# Altium schematic sheet HBridge.SchDoc
size A4; SheetNumber: 8; SheetTotal: 13
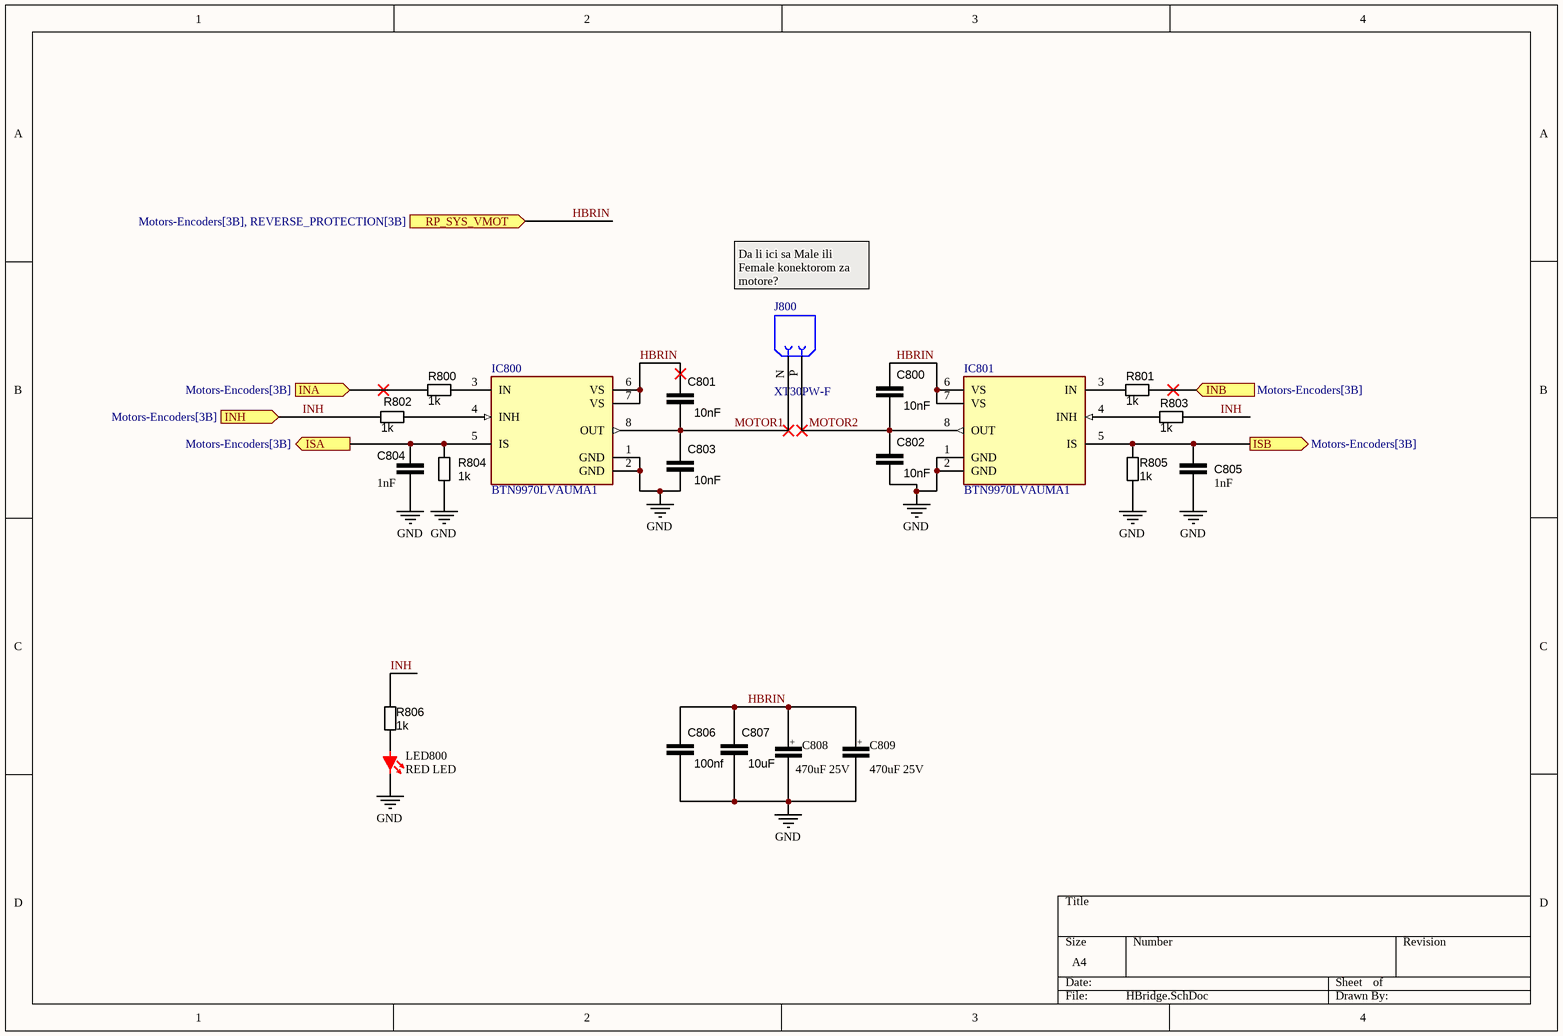
[diagram p0: HBridge.SchDoc]

## Parts
C800  10nF  [CAP_0603]
C801  10nF  [CAP_0603]
C802  10nF  [CAP_0603]
C803  10nF  [CAP_0603]
C804  1nF  [CAP_0603]
C805  1nF  [CAP_0603]
C806  100nf  [CAP_0603]
C807  10uF  [CAP_0603]
C808  470uF 25V  [WCAP-ATG5_8X11.5(DXL)]
C809  470uF 25V  [WCAP-ATG5_8X11.5(DXL)]
IC800  BTN9970LVAUMA1  [FP-PG-HSOF-7-MFG]
IC801  BTN9970LVAUMA1  [FP-PG-HSOF-7-MFG]
J800  XT30PW-F  [AMASS_XT30PW-F]
LED800  RED LED  [DIOC1608X04N-RED]
R800  1k  [RES_0603]
R801  1k  [RES_0603]
R802  1k  [RES_0603]
R803  1k  [RES_0603]
R804  1k  [RES_0603]
R805  1k  [RES_0603]
R806  1k  [RES_0603]

## Ports
INA (in, see Motors-Encoders[3B]), INB (in, see Motors-Encoders[3B]), INH (in, see Motors-Encoders[3B]), ISA (out, see Motors-Encoders[3B]), ISB (out, see Motors-Encoders[3B]), RP_SYS_VMOT (in, see Motors-Encoders[3B], REVERSE_PROTECTION[3B])

## Nets
GND: C802.1 C803.1 C804.1 C805.1 C806.1 C807.1 C808.2(NEG) C809.2(NEG) IC800.1(GND) IC800.2(GND) IC801.1(GND) IC801.2(GND) LED800.2 R804.2 R805.2
HBRIN: C800.2 C801.2 C806.2 C807.2 C808.1(POS) C809.1(POS) IC800.6(VS) IC800.7(VS) IC801.6(VS) IC801.7(VS) ; port RP_SYS_VMOT
INA: R800.2 ; port INA
INB: R801.2 ; port INB
INH: R802.2 R803.2 R806.1 ; port INH
ISA: C804.2 IC800.5(IS) R804.1 ; port ISA
ISB: C805.2 IC801.5(IS) R805.1 ; port ISB
MOTOR1: C801.1 C803.2 IC800.8(OUT) J800.N
MOTOR2: C800.1 C802.2 IC801.8(OUT) J800.P
NetIC800_3: IC800.3(IN) R800.1
NetIC800_4: IC800.4(INH) R802.1
NetIC801_3: IC801.3(IN) R801.1
NetIC801_4: IC801.4(INH) R803.1
NetLED800_1: LED800.1 R806.2

## Notes on the sheet
- Da li ici sa Male ili Female konektorom za motore?
- (in symbol WCAP-ATG5_8X11.5) +

## Library data of the parts
C800-C803 = C000007: CAP CER 10nF 0603 25V X7R; capaticanse: 100nf; ComponentLink1Description: digikey; ComponentLink1URL: https://www.digikey.com/en/products/detail/kyocera-avx/06033C104K4T2A/8019250
C804 C805 = C000021: CAP CER 1nF 0603 25V X7R; capacitance: 82pF; ComponentLink1Description: DigiKey; ComponentLink1URL: https://www.digikey.com/en/products/detail/kyocera-avx/KGM15ACG1E820FT/1599315?s=N4IgjCBcoMxaBjKAzAhgGwM4FMA0IB7KAbXDBggF18AHAFyhAGU6AnASwDsBzEAX3xgALPBBJIaLHkIlwAVgCcAJiEB2ENRD1GLDj36CAbKPGSc%2BIpFIxlQ45u2RmbLrwEglABiEKTKDOYyViAAHEoABDQAYhq0DE4AqpzsdADyyACy2KiYAK6s2AYgALRKfpBsudKWpHIafA1AA; DigiKey Part Number: 478-KGM15ACG1E820FTCT-ND
C806 = C000007: CAP CER 100nF 0603 25V X7R; capaticanse: 100nf; ComponentLink1Description: digikey; ComponentLink1URL: https://www.digikey.com/en/products/detail/kyocera-avx/06033C104K4T2A/8019250
C807 = C000007: CAP CER 10uF 0603 25V X7R; capaticanse: 100nf; ComponentLink1Description: digikey; ComponentLink1URL: https://www.digikey.com/en/products/detail/kyocera-avx/06033C104K4T2A/8019250
C808 C809 = WCAP-ATG5_8X11.5: <b>WCAP-ATG5 Aluminium Electrolytic Capacitors </B><BR><BR> <B>General Purpose +105 Â°C </B><BR><BR> <B>Characteristics</B><BR> <BR>General purpose product series with max. operating temperature of +105 Â°C  <BR>Mounting style: THT Radial  <BR>Capacitance range: 0.1 ÂµF â€’ 18000 ÂµF  <BR>Capacitance tolerance: Â±20 %  <BR>Operating temperature:  <BR>-40 Â°C up to +105 Â°C for UR < 400 V(DC)  <BR>-25 Â°C up to +105 Â°C for UR â‰¥ 400 V(DC)  <BR>Endurance: 2000 h @ +105 Â°C  <BR>Dimensions (DxL) in mm: 5.0 x 11.0 up to 22.0 x 31.0  <BR>Recommended soldering: Wave soldering  <BR> <BR> <B>Applications</B><BR> <BR>Filtering  <BR>Smoothing  <BR>Energy storage  <BR>Coupling  e.g. Switched-mode power supply, AC/DC converter, adapter, charger, digital camera  <BR> <BR><BR> <BR> <br><a href="https://www.we-online.com/catalog/media/o683503v209%20family-wcap-atg5-860020672004.jpg" title="Enlarge picture"> <img src="https://www.we-online.com/catalog/media/o683503v209%20family-wcap-atg5-860020672004.jpg"  width="320"></a><p> </b><br>             Details see: <a href="www.we-online.com/catalog/WCAP-ATG5/?utm_source=eagle_model&utm_medium=description_link&utm_campaign=eisos_eagle">www.we-online.com/catalog/WCAP-ATG5</a><p> Updated by yingchun,Shan;2020-02-28 <br>2020(C) WÃ¼rth Elektronik; MF: {'manufacturer': u'W\xfcrth Elektronik'}; MP: 860020474014; Package: None; Price: None; Value: *; Availability: Unavailable
IC800 IC801 = CMP-32854-000022-1: DC_MOTOR_CONTROL PG-HSOF-7
J800 = XT30PW-F: MF: {'manufacturer': u'amass'}; Package: None; Price: None; Value: *; MP: XT30PW-F; Availability: Unavailable
LED800 = 00000008: LED RED DIFFUSED 0603 SMD; Supplier 1: Avnet; Supplier Part Number 1: Q65111A3964; ComponentLink1Description: Digikey; ComponentLink1URL: https://www.digikey.com/en/products/detail/ams-osram-usa-inc/LG-Q396-PS-35/5249855
R800-R806 = R000004: RES 1k OHM 1% 1/10W 0603; resistance: 1Kohm; ComponentLink1Description: digikey; ComponentLink1URL: https://www.digikey.com/en/products/detail/vishay-beyschlag-draloric-bc-components/MCT06030C1001FP500/2607821